# EAGLE board Fuel_Cell_Controller (EAGLE 9.1.1), part 1 of 2
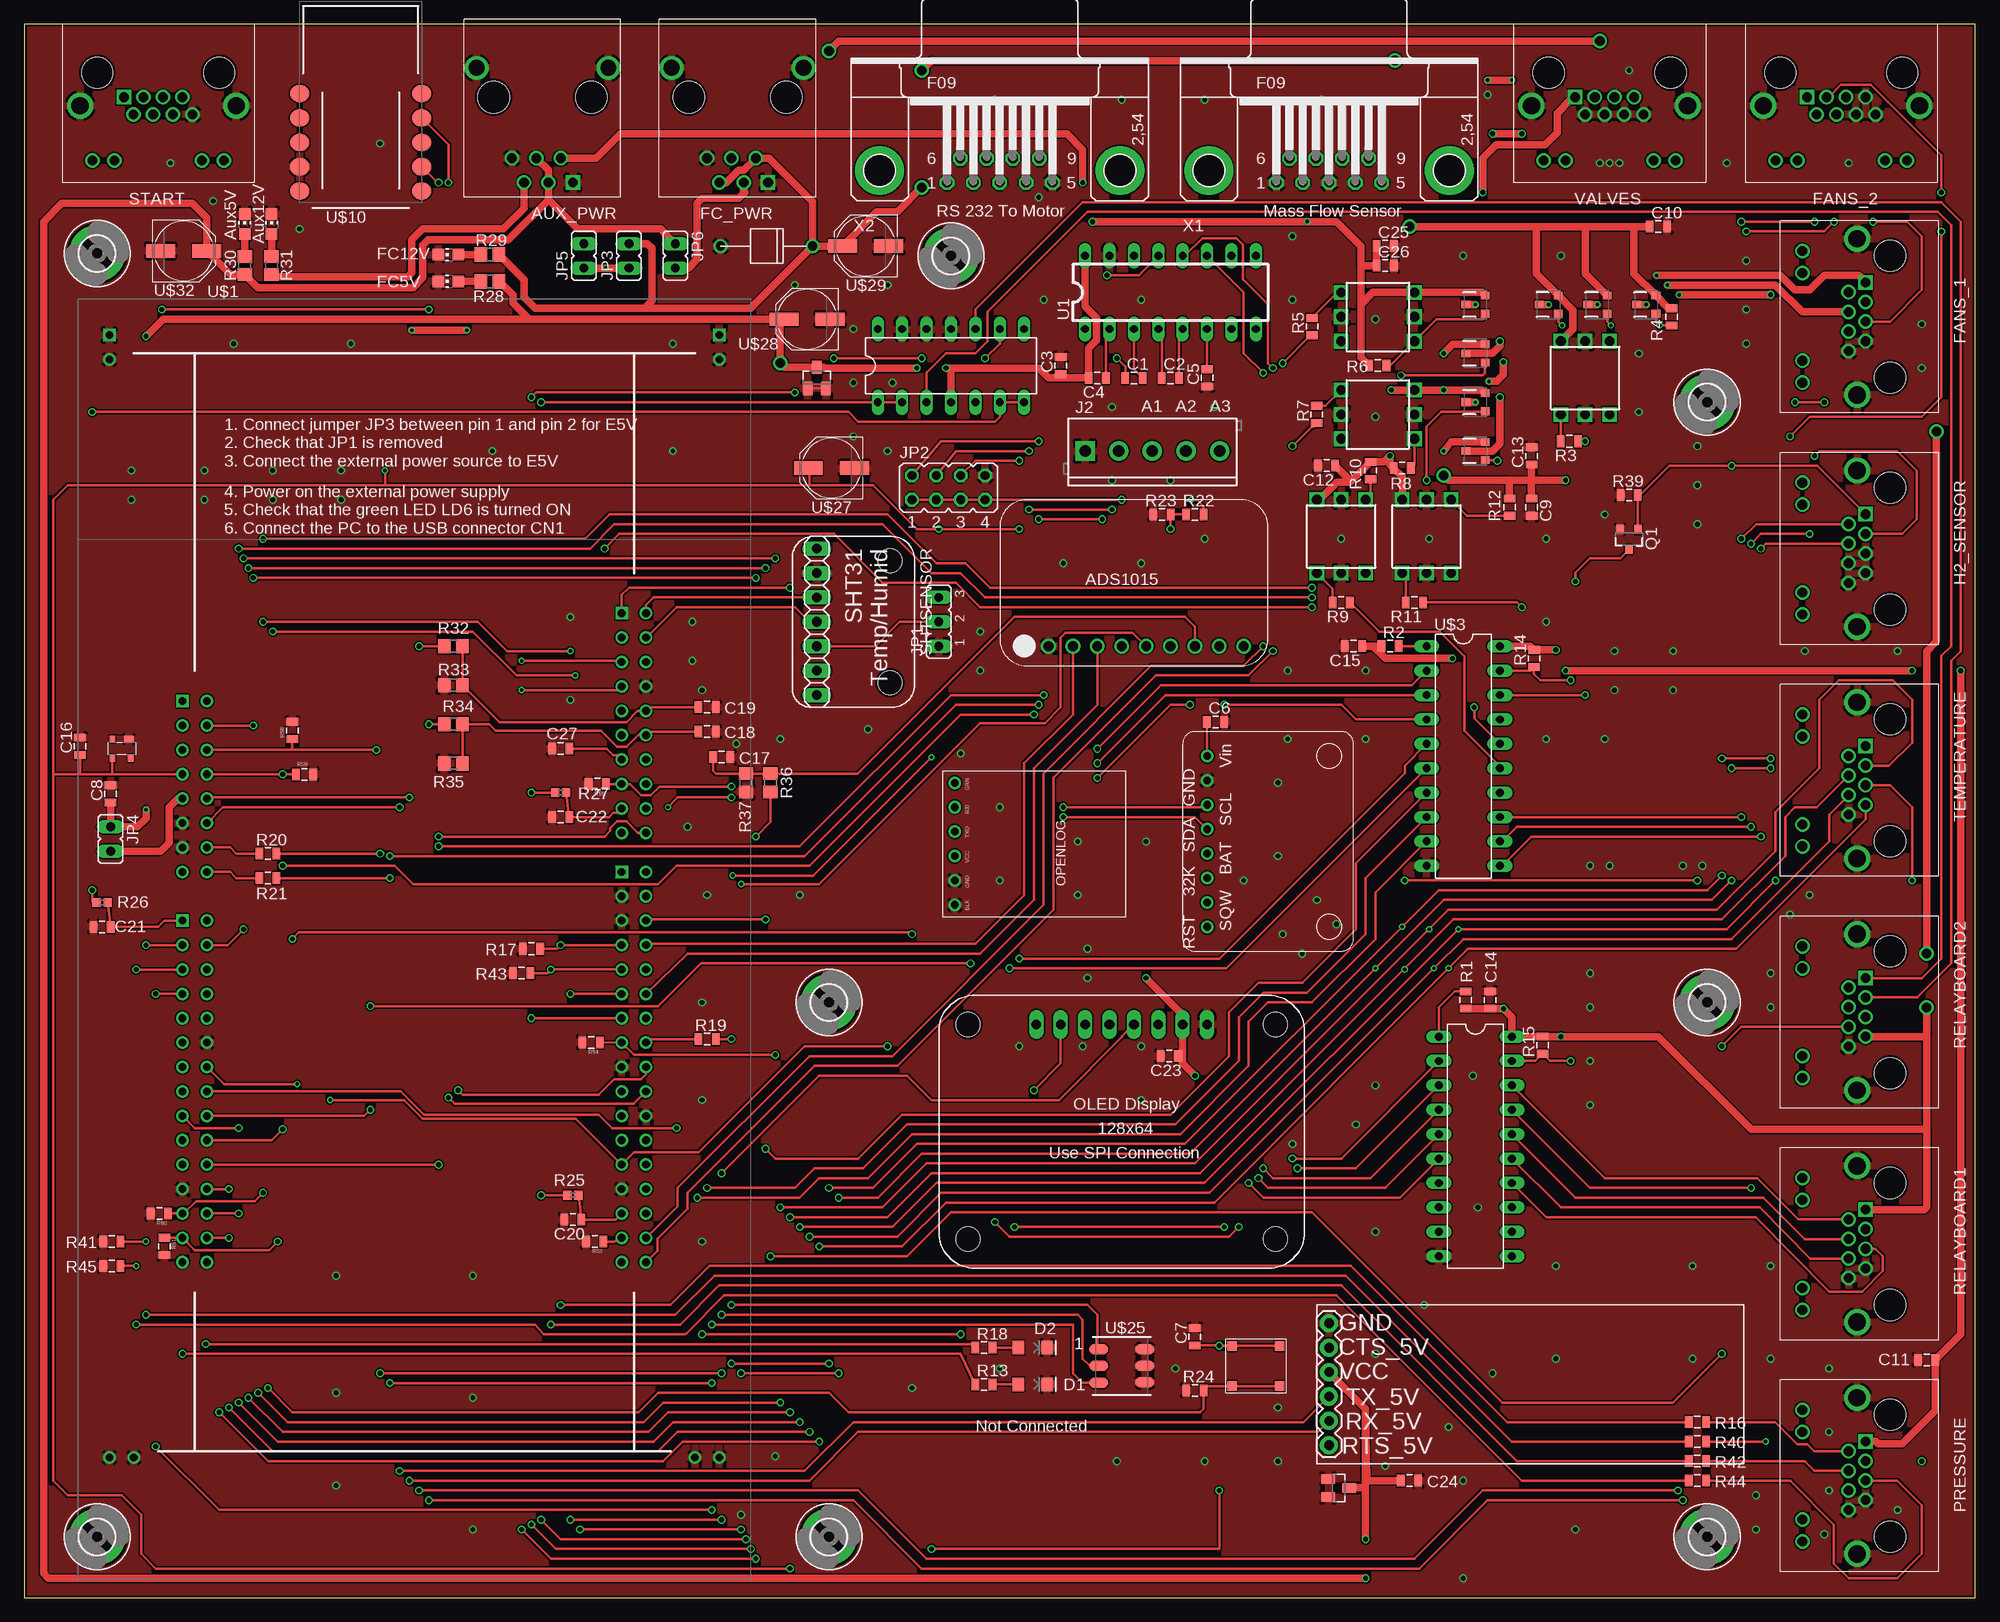
[diagram p10: board, top side]
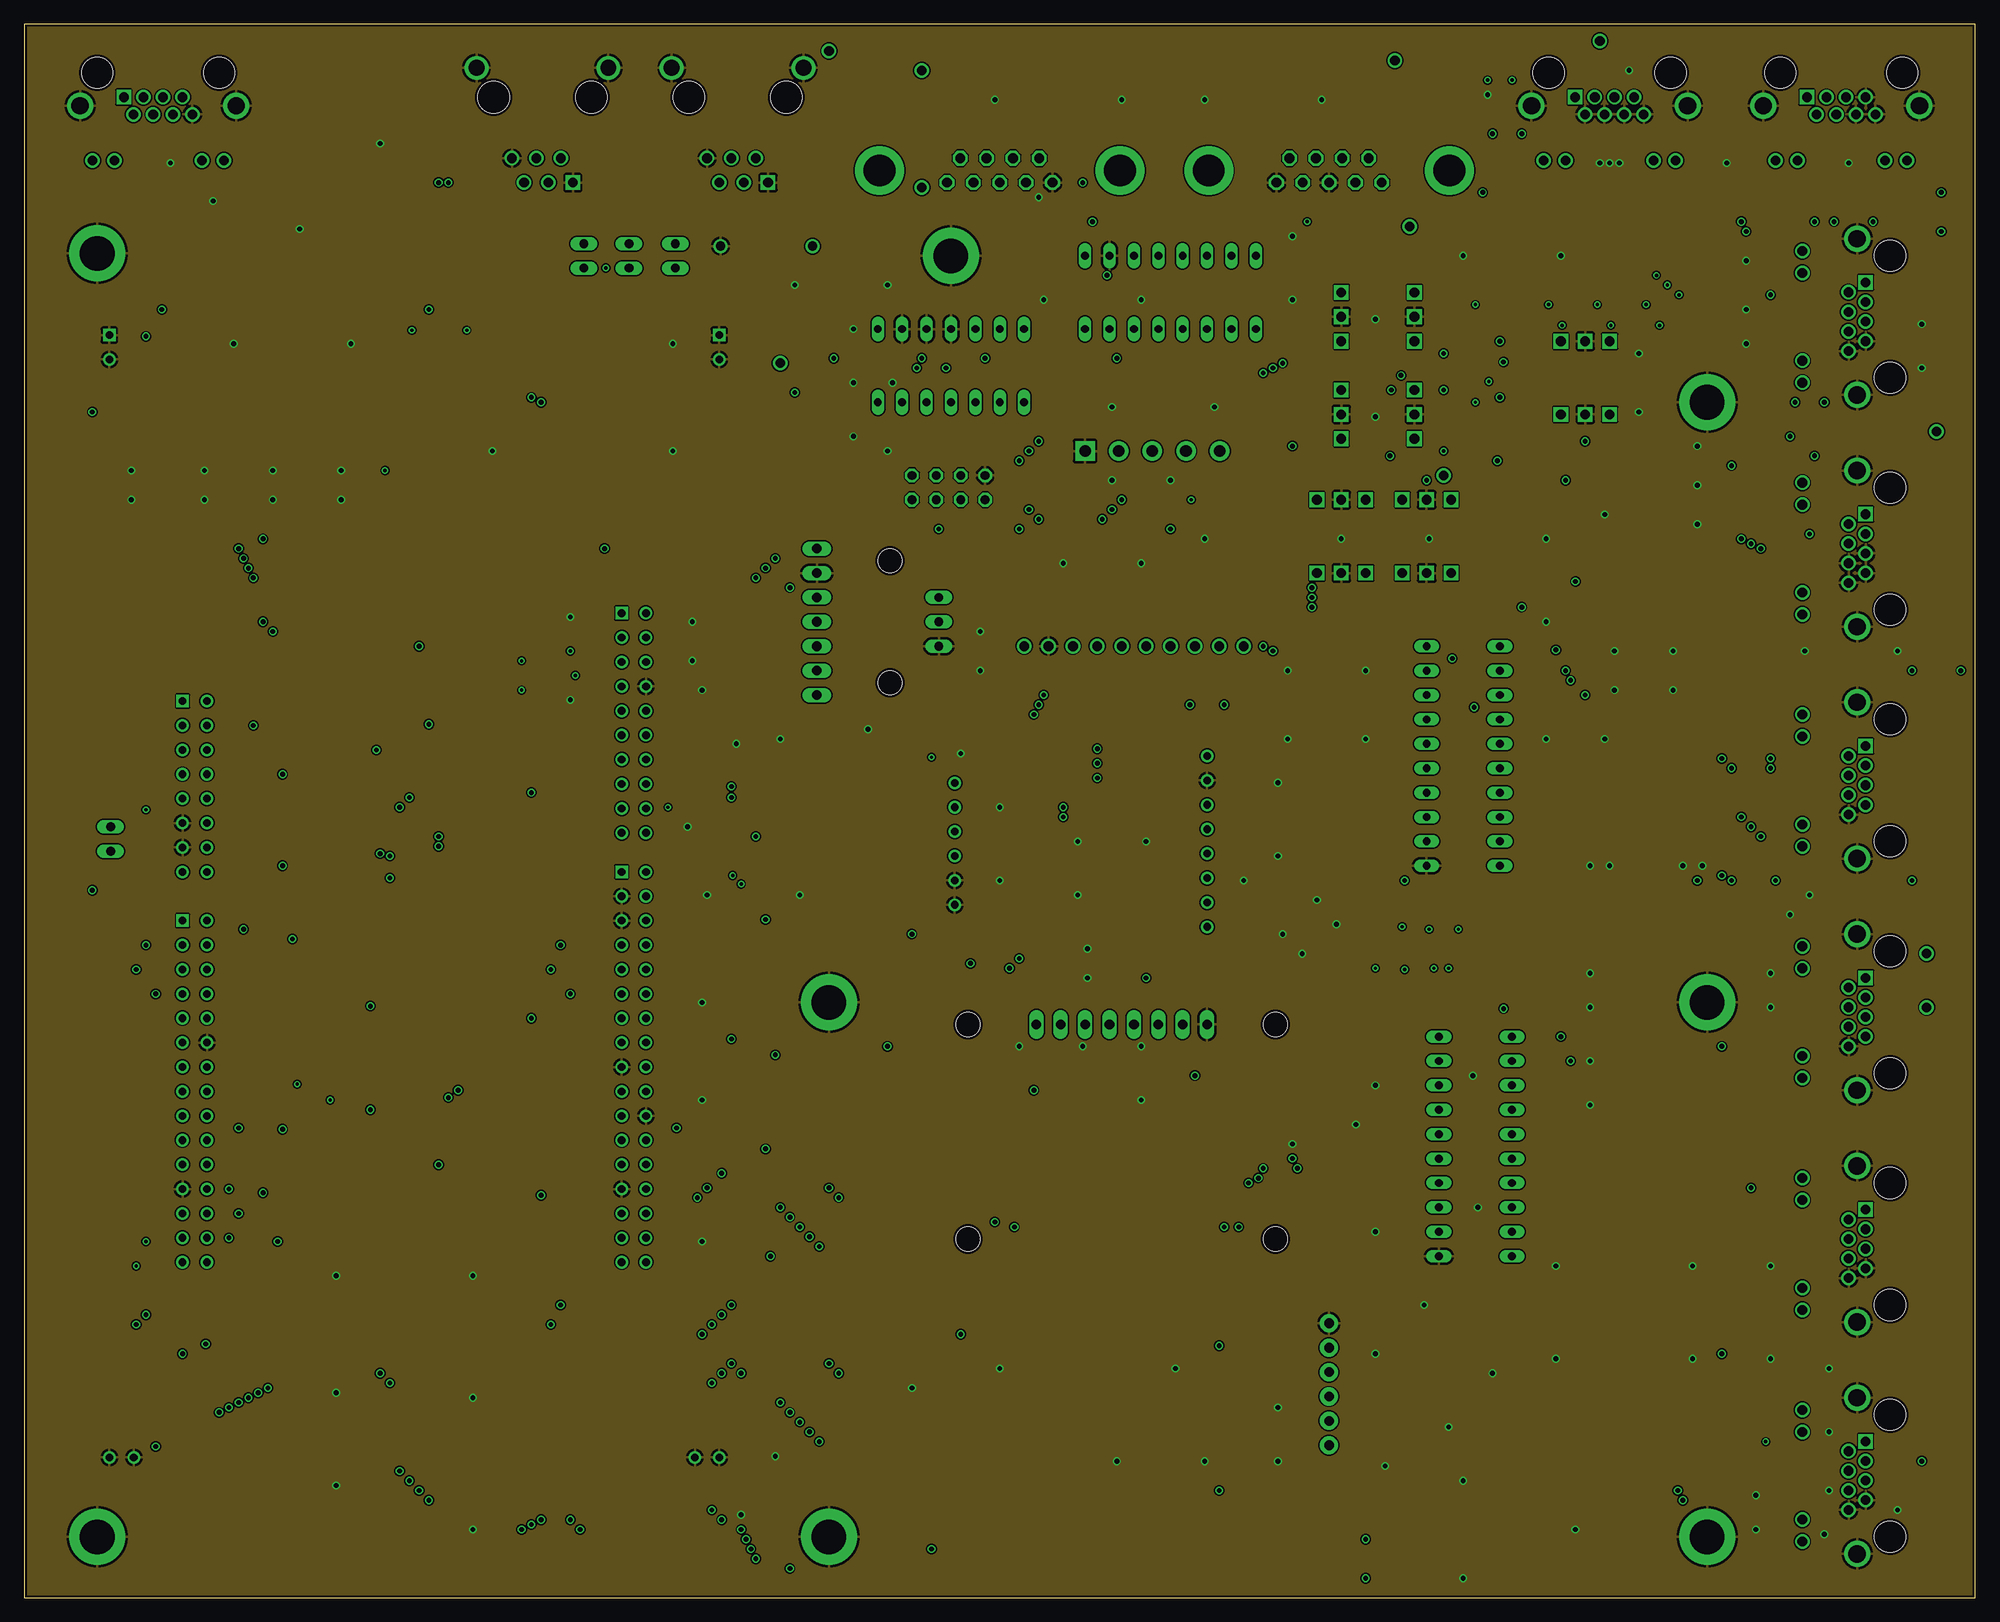
[diagram p11: board, inner layer Route15]
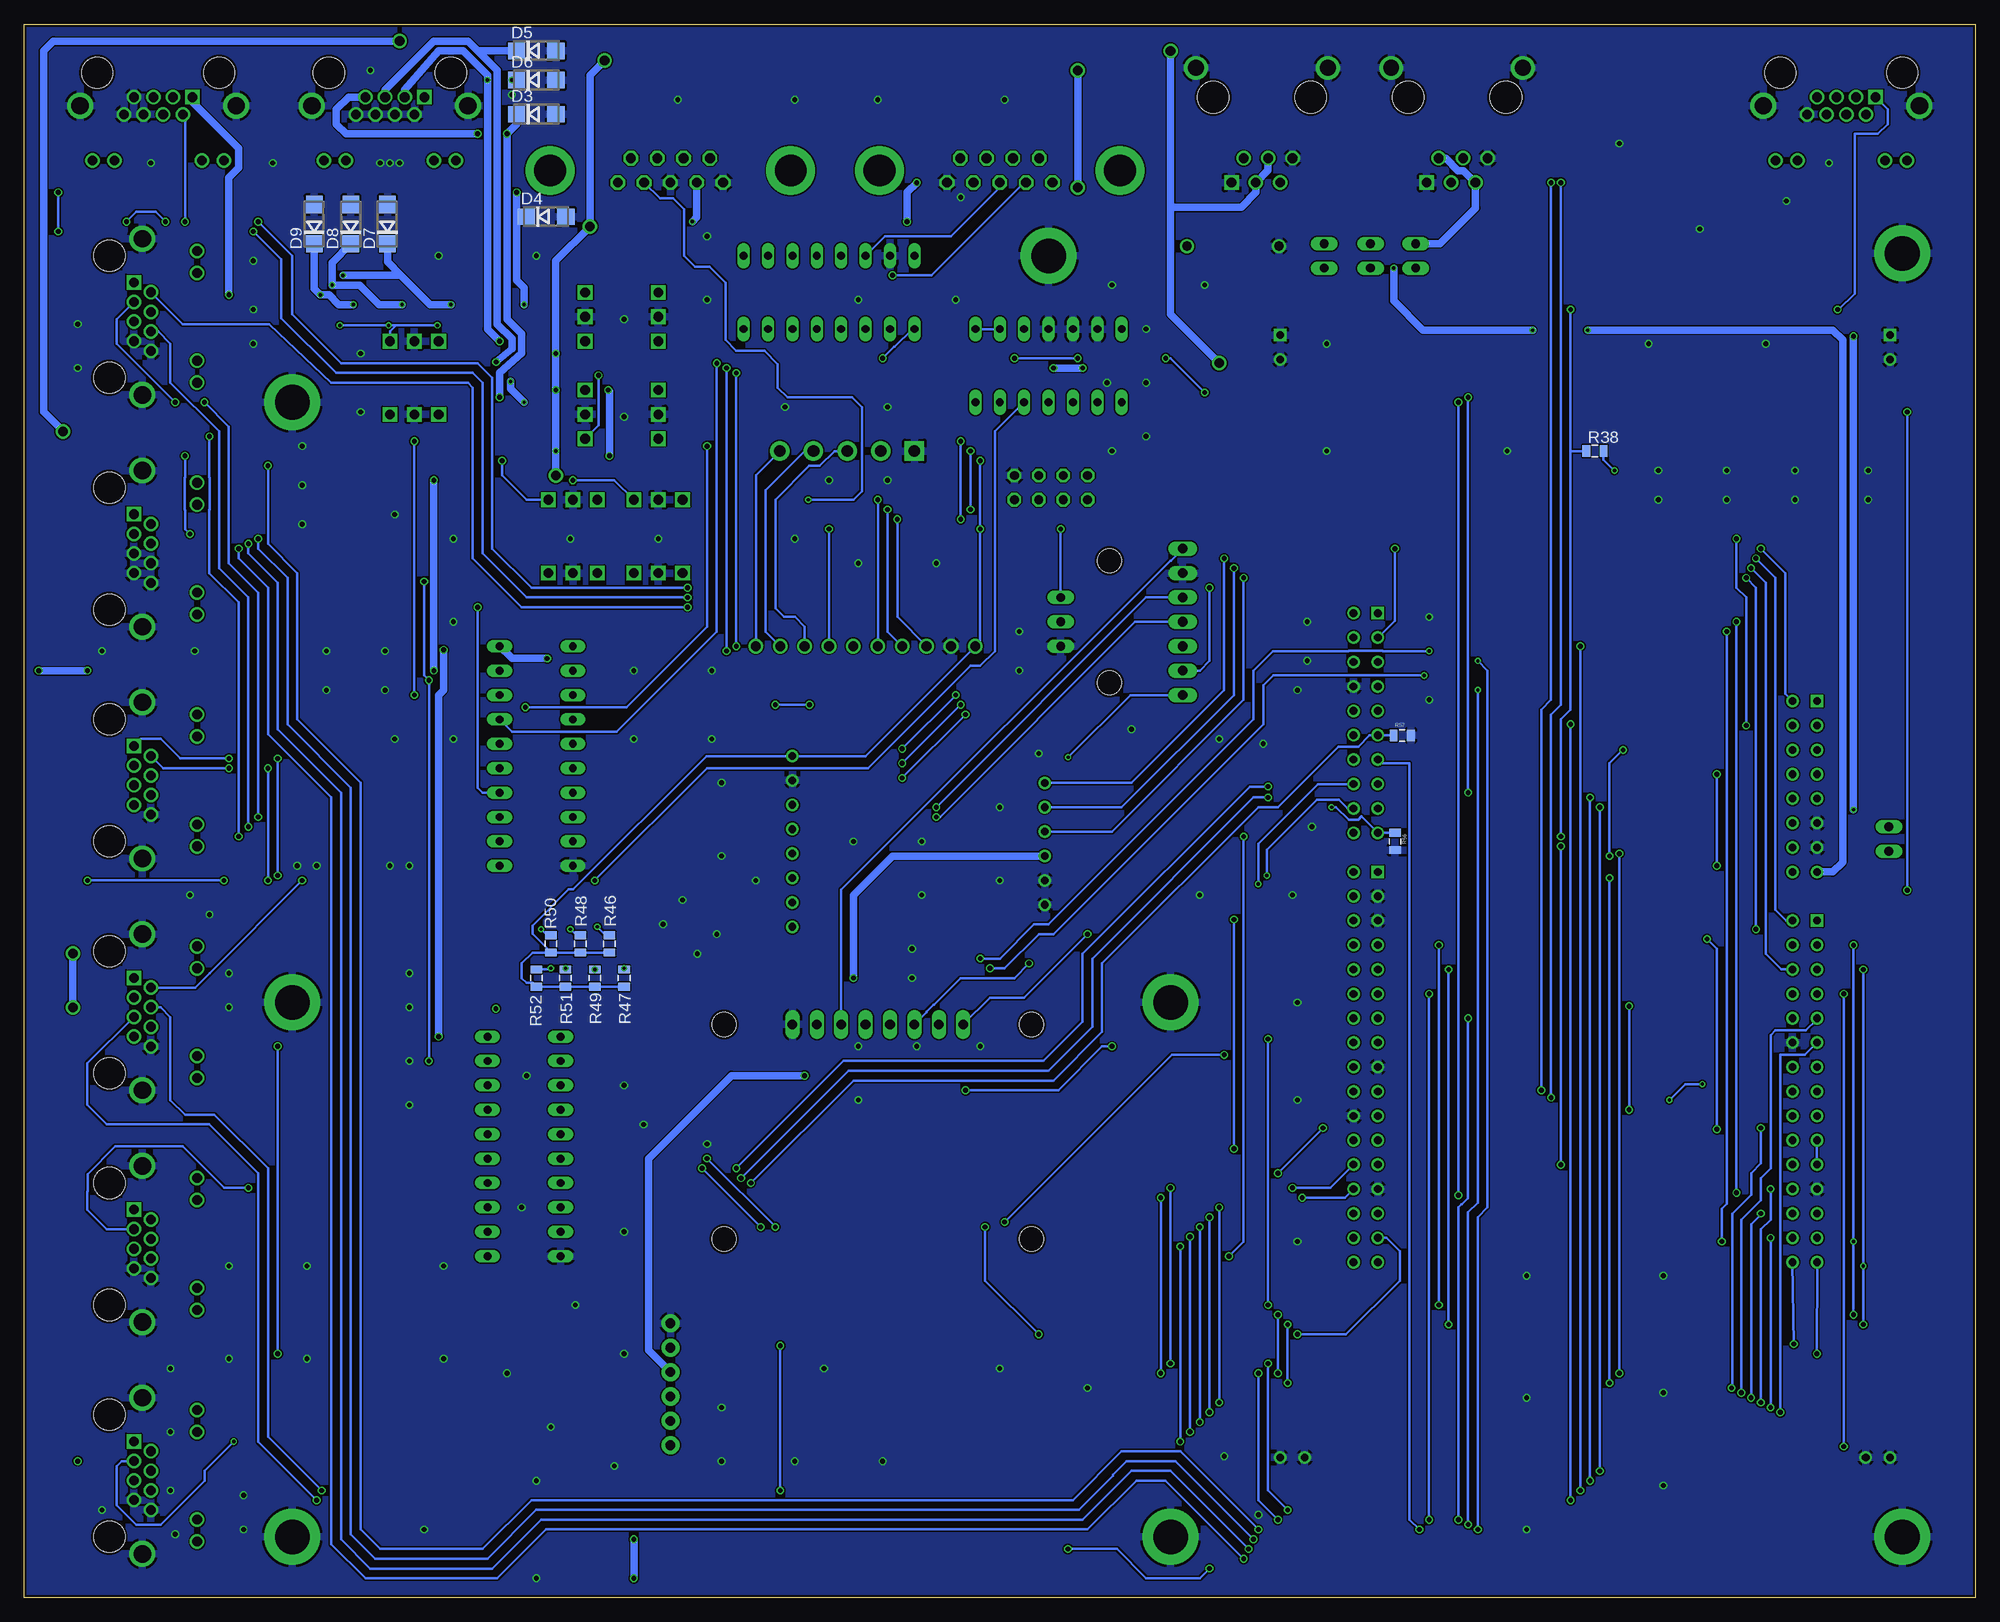
[diagram p12: board, bottom side, seen from below]

Size 203.2 x 163.83 mm. Coordinates in mm from the lower left corner, seen from the top.
Outline: 0,0 203.2,0 203.2,163.83 0,163.83 0,0
Copper layers (1+2+15+16): Top 0.035mm / dielectric 0.75mm / Route2 0.035mm / dielectric 0.75mm / Route15 0.035mm / dielectric 0.75mm / Bottom 0.035mm
Design rules "SeeedStudio_2layer_DRU_no_angle_20140221 *": minimum track width 6mil, minimum drill 12mil, track to track 6mil, track to pad 6mil, pad to pad 6mil, via to via 6mil, smd to smd 0mil, copper to edge 10mil, drill to drill 10mil, minimum pad ring 10mil, minimum via ring 6mil, stop-mask expansion 2mil, vias tented up to drill 100mil, thermal gap 10mil

## Footprints (pad centres in the part's own frame; a part is rotated, then mirrored left to right if it is on the bottom)
CHIP-LED0805 = smd 1.2 x 1.2: A 0,-1.05; C 0,1.05
1734723-1_RJ11 = drill 1 square: 1 -3.81,2.54 | drill 1: 2 -2.54,0; 3 -1.27,2.54; 4 0,0; 5 1.27,2.54; 6 2.54,0 | drill 1.65: SH1 -7.5,-9.4; SH2 6.22,-9.4 | hole 3.3: -5.72,-6.35; 4.44,-6.35
0805 = smd 0.8 x 1.2: 1 -0.9,0; 2 0.9,0
LED-1206 = smd 1.2 x 1.4: A -1.5,0; C 1.5,0
DO214AC = smd 1.8 x 1.7: A 2.05,0; C -2.05,0
A122645-ND = drill 1 square: P$1 3.58,2.54 | drill 1: P$2 2.56,4.32; P$3 1.54,2.54; P$4 0.52,4.32; P$5 -0.5,2.54; P$6 -1.52,4.32; P$7 -2.54,2.54; P$8 -3.56,4.32; P$9 -6.86,9.14; P$10 -4.57,9.14; P$11 4.57,9.14; P$12 6.86,9.14 | drill 1.8: P$13 -8.13,3.43; P$14 8.13,3.43 | hole 3.25: -6.35,0; 6.35,0
3,6-PAD = drill 3.6 pad 5.842: B3,6 0,0
1X06BLUETOOTH = drill 1.016 pad 1.88: 1 43.18,1.905; 2 43.18,4.445; 3 43.18,6.985; 4 43.18,9.525; 5 43.18,12.065; 6 43.18,14.605
SCREWTERMINAL-3.5MM-5 = drill 1.2 pad 2.032 square: 1 0,0 | drill 1.2 pad 2.032: 2 3.5,0; 3 7,0; 4 10.5,0; 5 14,0
JP2 = drill 0.914 long: 1 -2.54,0; 2 0,0; 3 2.54,0
JP4Q = drill 0.914 octagon: 1 -3.81,-1.27; 2 -3.81,1.27; 3 -1.27,-1.27; 4 -1.27,1.27; 5 1.27,-1.27; 6 1.27,1.27; 7 3.81,-1.27; 8 3.81,1.27
JP1 = drill 0.914 long: 1 0,-1.27; 2 0,1.27
DIL14 = drill 0.813 long: 1 -7.62,-3.81; 2 -5.08,-3.81; 3 -2.54,-3.81; 4 0,-3.81; 5 2.54,-3.81; 6 5.08,-3.81; 7 7.62,-3.81; 8 7.62,3.81; 9 5.08,3.81; 10 2.54,3.81; 11 0,3.81; 12 -2.54,3.81; 13 -5.08,3.81; 14 -7.62,3.81
SOT23-3 = smd 0.8 x 0.9: 1 -0.95,-1; 2 0.95,-1; 3 0,1.1
0402 = smd 0.85 x 0.9: 1 -0.58,0; 2 0.58,0
R0805 = smd 1.3 x 1.5: 1 -0.95,0; 2 0.95,0
1X07-SHT31-DIS = drill 1.016 long: 1 -7.62,0; 2 -5.08,0; 3 -2.54,0; 4 0,0; 5 2.54,0; 6 5.08,0; 7 7.62,0 | hole 2.54: -6.35,7.62; 6.35,7.62
DIL16 = drill 0.813 long: 1 -8.89,-3.81; 2 -6.35,-3.81; 3 -3.81,-3.81; 4 -1.27,-3.81; 5 1.27,-3.81; 6 3.81,-3.81; 7 6.35,-3.81; 8 8.89,-3.81; 9 8.89,3.81; 10 6.35,3.81; 11 3.81,3.81; 12 1.27,3.81; 13 -1.27,3.81; 14 -3.81,3.81; 15 -6.35,3.81; 16 -8.89,3.81
NUCLEO-F746ZG = drill 0.8: 3V3 -24.13,17.151; 5V -24.13,14.611; AGND 21.59,4.451; AVDD1 24.13,28.835; GND1 -24.13,12.071; GND2 -24.13,9.531; GND4 -31.75,60.33; GND6 31.75,60.33; GND7 31.75,-53.969; GND8 29.21,-53.969; GND9 -29.21,-53.969; GND10 -31.75,-53.969; GND11 -24.13,-26.029; GND12 -21.59,-10.789; GND13 24.13,26.295; GND14 21.59,-13.329; GND15 21.59,-26.029; GND16 21.59,1.911; GND17 24.13,-18.409; IOREF -24.13,22.231; NC2 -24.13,-13.329; NRST -24.13,19.691; PA_0 21.59,-28.569; PA_4 21.59,13.595; PA_5 24.13,23.755; PA_6 24.13,21.215; PA_7A -24.13,-15.869; PA_7B 24.13,18.675; PA_15 21.59,23.755; PB_0 21.59,-31.109; PB_1 21.59,-0.629; PB_2 21.59,-10.789; PB_3 21.59,16.135; PB_4 21.59,11.055; PB_5 21.59,18.675; PB_6 21.59,-8.249; PB_8 24.13,33.915; PB_9 24.13,31.375; PB_10 24.13,-31.109; PB_11 24.13,-33.649; PB_12 21.59,26.295; PB_13 21.59,28.835; PB_15 21.59,31.375; PC_0 -24.13,-0.629; PC_2 21.59,-3.169; PC_3 -24.13,-3.169; PC_7 21.59,21.215; PC_8 -21.59,24.771; PC_9 -21.59,22.231; PC_10 -21.59,19.691; PC_11 -21.59,17.151; PC_12 -21.59,14.611; PD_0 -24.13,-28.569; PD_1 -24.13,-31.109; PD_2 -21.59,12.071; PD_3 -21.59,-8.249; PD_4 -21.59,-5.709; PD_5 -21.59,-3.169; PD_6 -21.59,-0.629; PD_7 -21.59,1.911; PD_11 21.59,-20.949; PD_12 21.59,-18.409; PD_13 21.59,-15.869; PD_14 24.13,16.135; PD_15 24.13,13.595; PE_0 21.59,-33.649; PE_2A -21.59,-13.329; PE_2B 21.59,-23.489; PE_3 -21.59,-23.489; PE_4 -21.59,-15.869; PE_5 -21.59,-18.409; PE_6 -21.59,-20.949; PE_7 24.13,-15.869; PE_8 24.13,-13.329; PE_9 24.13,4.451; PE_10 24.13,-20.949; PE_11 24.13,1.911; PE_12 24.13,-23.489; PE_13 24.13,-3.169; PE_14 24.13,-26.029; PE_15 24.13,-28.569; PF_2 -24.13,-18.409; PF_3 -24.13,-5.709; PF_4 21.59,-5.709; PF_5 -24.13,-8.249; PF_7 -21.59,-28.569; PF_8 -21.59,-26.029; PF_9 -21.59,-31.109; PF_10 -24.13,-10.789; PF_12 24.13,11.055; PF_13 24.13,6.991; PF_14 24.13,-0.629; PF_15 24.13,-5.709; PG_0 -24.13,-33.649; PG_1 -21.59,-33.649; PG_2 -21.59,9.531; PG_3 -21.59,6.991; PG_9 24.13,-10.789; PG_14 24.13,-8.249; PH_0 -24.13,-23.489; PH_1 -24.13,-20.949; VIN -24.13,6.991 | drill 0.8 square: AVDD2 21.59,6.991; GND3 -31.75,62.87; GND5 31.75,62.87; NC1 -24.13,24.771; PA_3 -24.13,1.911; PC_6 21.59,33.915
OPENLOG = drill 0.8: P$1 -6.35,-8.255; P$2 -3.81,-8.255; P$3 -1.27,-8.255; P$4 1.27,-8.255; P$5 3.81,-8.255; P$6 6.35,-8.255
DIL20 = drill 0.813 long: 1 -11.43,-3.81; 2 -8.89,-3.81; 3 -6.35,-3.81; 4 -3.81,-3.81; 5 -1.27,-3.81; 6 1.27,-3.81; 7 3.81,-3.81; 8 6.35,-3.81; 9 8.89,-3.81; 10 11.43,-3.81; 11 11.43,3.81; 12 8.89,3.81; 13 6.35,3.81; 14 3.81,3.81; 15 1.27,3.81; 16 -1.27,3.81; 17 -3.81,3.81; 18 -6.35,3.81; 19 -8.89,3.81; 20 -11.43,3.81
H11L1 = drill 1.016 square: 3 -3.81,-2.54; ANODE -3.81,2.54; CATHODE -3.81,0; GND 3.81,0; VCC 3.81,2.54; VO 3.81,-2.54
DMP3056L-7 = smd 0.8 x 0.9: D 0,1; G -0.95,-1; S 0.95,-1
UMFT234XF = smd 1.755 x 2.025: 1 -0.89,-6.35; 2 1.65,-6.35; 3 4.19,-6.35; 4 6.73,-6.35; 5 9.27,-6.35; 6 9.27,6.35; 7 6.73,6.35; 8 4.19,6.35; 9 1.65,6.35; 10 -0.89,6.35
DS3231 = drill 0.8: P$1 2.54,2.54; P$2 5.08,2.54; P$3 7.62,2.54; P$4 10.16,2.54; P$5 12.7,2.54; P$6 15.24,2.54; P$7 17.78,2.54; P$8 20.32,2.54
ADS1015 = drill 1.016: P$1 -11.43,0; P$2 -8.89,0; P$3 -6.35,0; P$4 -3.81,0; P$5 -1.27,0; P$6 1.27,0; P$7 3.81,0; P$8 6.35,0; P$9 8.89,0; P$10 11.43,0
SOT143_AVAGO = smd 1 x 0.7: GND -0.75,-1 | smd 0.6 x 0.7: IO1 0.95,-1; IO3 -0.95,1; VDD 0.95,1
SOT23 = smd 1 x 1.4: A1 -0.95,-1.1; A2 0.95,-1.1; C 0,1.1
DO-204AC = drill 0.95: ANODE 0,0; CATHODE 9.6,0
5060BRG4 = smd 2 x 1.1: 1 2.4,-1.75; 2 2.4,0; 3 2.4,1.75; 4 -2.4,1.7; 5 -2.4,0; 6 -2.4,-1.75
EG4621CT-ND = smd 1 x 1: P$1 -2.475,2.1; P$2 2.475,2.1; P$3 -2.475,-2.1; P$4 2.475,-2.1
PANASONIC_D = smd 3 x 1.4: + 2.4,0; - -2.4,0
1X08OLED = drill 1.016 long: P$1 -8.89,25.4; P$2 -6.35,25.4; P$3 -3.81,25.4; P$4 -1.27,25.4; P$5 1.27,25.4; P$6 3.81,25.4; P$7 6.35,25.4; P$8 8.89,25.4 | hole 2.54: -16.002,3.048; 16.002,3.048; 16.002,25.4; -16.002,25.4
F09HP = drill 1.016 octagon: 1 -5.486,-1.27; 2 -2.743,-1.27; 3 0,-1.27; 4 2.743,-1.27; 5 5.486,-1.27; 6 -4.115,1.27; 7 -1.372,1.27; 8 1.372,1.27; 9 4.115,1.27 | drill 3.302 pad 5.08: G1 -12.522,0; G2 12.522,0

## Placement (x,y rotation side)
AUX5VLED  [CHIP-LED0805]  22.99,143 0 top
AUX12VLED  [CHIP-LED0805]  25.78,143 0 top
AUX_PWR  5555140-6  [1734723-1_RJ11]  53.34,149.86 180 top
C1  1µF  [0805]  115.57,127 0 top
C2  1µF  [0805]  119.38,127 0 top
C3  1µF  [0805]  107.95,128.27 90 top
C4  1µF  [0805]  111.76,127 180 top
C5  1µF  [0805]  123.19,127 90 top
C6  0.1µF  [0805]  124.08,91.19 0 top
C7  0.1µF  [0805]  121.92,27.18 90 top
C8  1µF  [0805]  9.02,83.69 90 top
C9  10µF  [0805]  156.97,113.54 270 top
C10  10µF  [0805]  170.18,142.75 0 top
C11  10µF  [0805]  198.12,24.77 180 top
C12  10µF  [0805]  135.64,117.86 180 top
C13  10µF  [0805]  156.97,118.87 90 top
C14  0.1µF  [0805]  152.65,62.23 90 top
C15  0.1µF  [0805]  138.43,99.06 180 top
C16  0.1µF  [0805]  5.84,88.65 90 top
C17  [0805]  72.64,87.5 0 top
C18  [0805]  71.12,90.17 0 top
C19  [0805]  71.12,92.71 0 top
C20  [0805]  57.15,39.37 180 top
C21  [0805]  8.13,69.85 180 top
C22  [0805]  55.88,81.28 180 top
C23  1µF  [0805]  119.25,56.39 180 top
C24  1µF  [0805]  144.27,12.19 0 top
C25  10µF  [0805]  141.73,140.72 0 top
C26  10µF  [0805]  141.73,138.68 0 top
C27  1µF  [0805]  55.88,88.39 180 top
D1  RED  [LED-1206]  105.03,22.23 0 top
D2  YELLOW  [LED-1206]  105.03,26.04 0 top
D3  [DO214AC]  149.86,154.43 0 bottom
D4  [DO214AC]  148.84,143.76 0 bottom
D5  [DO214AC]  149.86,161.04 0 bottom
D6  [DO214AC]  149.86,157.99 0 bottom
D7  [DO214AC]  165.35,143 90 bottom
D8  [DO214AC]  169.16,143 90 bottom
D9  [DO214AC]  172.97,143 90 bottom
FANS_1  ETHERNET  [A122645-ND]  194.31,133.35 90 top
FANS_2  ETHERNET  [A122645-ND]  189.23,158.75 180 top
FC5VLED  [CHIP-LED0805]  44.2,137.03 90 top
FC12VLED  [CHIP-LED0805]  44.2,139.83 90 top
FC_PWR  5555140-6  [1734723-1_RJ11]  73.66,149.86 180 top
H1  MOUNT-PAD-ROUND3.6  [3,6-PAD]  175.26,124.46 0 top
H2  MOUNT-PAD-ROUND3.6  [3,6-PAD]  175.26,61.98 0 top
H2_SENSOR  ETHERNET  [A122645-ND]  194.31,109.22 90 top
H3  MOUNT-PAD-ROUND3.6  [3,6-PAD]  175.26,6.35 0 top
H4  MOUNT-PAD-ROUND3.6  [3,6-PAD]  83.82,6.35 0 top
H5  MOUNT-PAD-ROUND3.6  [3,6-PAD]  83.82,61.98 0 top
H6  MOUNT-PAD-ROUND3.6  [3,6-PAD]  96.52,139.7 0 top
H7  MOUNT-PAD-ROUND3.6  [3,6-PAD]  7.62,139.95 0 top
H8  MOUNT-PAD-ROUND3.6  [3,6-PAD]  7.62,6.35 0 top
J1  BLUETOOTH  [1X06BLUETOOTH]  179.07,30.48 180 top
J2  [SCREWTERMINAL-3.5MM-5]  110.49,119.38 0 top
JP1  [JP2]  95.25,101.6 90 top
JP2  [JP4Q]  96.27,115.57 0 top
JP3  [JP1]  62.99,139.7 0 top
JP4  [JP1]  9.02,78.99 180 top
JP5  [JP1]  58.29,139.7 0 top
JP6  [JP1]  67.82,139.7 180 top
LP_FILTER_OP_AMP  TLV2404TLV2404  [DIL14]  96.52,128.27 0 top
PRESSURE  ETHERNET  [A122645-ND]  194.31,12.7 90 top
Q1  5.8A/30V/35mΩ  [SOT23-3]  167.13,110.24 180 top
R1  1kΩ  [0805]  150.11,62.23 90 top
R2  1kΩ  [0805]  142.24,99.06 0 top
R3  470Ω  [0805]  160.91,120.4 180 top
R4  10kΩ  [0805]  171.58,133.35 270 top
R5  470Ω  [0805]  134.11,132.33 90 top
R6  10kΩ  [0805]  140.97,128.27 0 top
R7  470Ω  [0805]  134.62,123.19 90 top
R8  10kΩ  [0805]  143.51,117.6 0 top
R9  470Ω  [0805]  137.16,103.63 180 top
R10  10kΩ  [0805]  140.21,117.35 270 top
R11  470Ω  [0805]  144.78,103.63 180 top
R12  10kΩ  [0805]  154.69,113.54 270 top
R13  324Ω  [0805]  99.95,22.23 0 top
R14  10kΩ  [0805]  157.23,97.79 90 top
R15  10kΩ  [0805]  158.12,57.53 90 top
R16  10kΩ  [0805]  174.24,18.29 0 top
R17  10kΩ  [0805]  52.83,67.56 0 top
R18  324Ω  [0805]  99.95,26.04 0 top
R19  324Ω  [0805]  71.12,58.17 0 top
R20  324Ω  [0805]  25.4,77.47 0 top
R21  324Ω  [0805]  25.4,74.93 0 top
R22  1kΩ  [0805]  121.92,112.78 0 top
R23  1kΩ  [0805]  118.49,112.78 0 top
R24  10kΩ  [0805]  121.92,21.59 0 top
R25  [0402]  57.15,41.91 180 top
R26  [0402]  8.13,72.39 180 top
R27  [0402]  55.88,83.82 0 top
R28  604Ω  [R0805]  48.51,137.03 0 top
R29  604Ω  [R0805]  48.51,139.83 0 top
R30  324Ω  [R0805]  22.99,138.68 270 top
R31  324Ω  [R0805]  25.78,138.68 270 top
R32  [R0805]  44.7,99.06 0 top
R33  [R0805]  44.7,95 180 top
R34  [R0805]  44.7,90.93 0 top
R35  [R0805]  44.7,86.87 180 top
R36  [R0805]  77.72,84.84 90 top
R37  [R0805]  75.18,84.84 270 top
R38  1kΩ  [0805]  39.62,119.38 0 bottom
R39  10kΩ  [0805]  167.13,114.81 0 top
R40  10kΩ  [0805]  174.24,16.26 0 top
R41  10kΩ  [0805]  9.14,37.08 0 top
R42  10kΩ  [0805]  174.24,14.22 0 top
R43  10kΩ  [0805]  51.82,65.02 0 top
R44  10kΩ  [0805]  174.24,12.19 0 top
R45  10kΩ  [0805]  9.14,34.54 0 top
R46  100kΩ  [0805]  142.24,68.07 90 bottom
R47  100kΩ  [0805]  140.72,64.52 90 bottom
R48  100kΩ  [0805]  145.29,68.07 90 bottom
R49  100kΩ  [0805]  143.76,64.52 90 bottom
R50  100kΩ  [0805]  148.34,68.07 270 bottom
R51  100kΩ  [0805]  146.81,64.52 270 bottom
R52  100kΩ  [0805]  149.86,64.52 270 bottom
R53  10kΩ  [0805]  59.44,37.08 180 top
R54  10kΩ  [0805]  59.04,57.81 180 top
R55  10kΩ  [0805]  59.69,84.71 180 top
R56  10kΩ  [0805]  60.45,78.74 270 bottom
R57  10kΩ  [0805]  59.69,89.79 0 bottom
R58  10kΩ  [0805]  27.94,90.3 90 top
R59  10kΩ  [0805]  29.21,85.72 0 top
R60  10kΩ  [0805]  14.1,40.01 180 top
R61  10kΩ  [0805]  14.61,36.58 270 top
RELAYBOARD1  ETHERNET  [A122645-ND]  194.31,36.83 90 top
RELAYBOARD2  ETHERNET  [A122645-ND]  194.31,60.96 90 top
SHTSENSOR  SHT31-DIS  [1X07-SHT31-DIS]  82.55,101.6 270 top
START  ETHERNET  [A122645-ND]  13.97,158.75 180 top
TEMPERATURE  ETHERNET  [A122645-ND]  194.31,85.09 90 top
U1  MAX232PTH  [DIL16]  119.38,135.89 0 top
U$1  NUCLEO-F746ZGNUCLEO-F746ZG  [NUCLEO-F746ZG]  40.64,68.58 0 top
U$2  OPENLOG  [OPENLOG]  105.16,78.49 270 top
U$3  SN74LVC245AN  [DIL20]  149.86,87.63 270 top
U$4  H11L1H11L1  [H11L1]  162.56,127 90 top
U$5  SN74LVC245AN  [DIL20]  151.13,46.99 270 top
U$6  H11L1H11L1  [H11L1]  140.97,133.35 0 top
U$7  DMP3056L-7DMP3056L-7  [DMP3056L-7]  158.75,134.62 90 top
U$8  DMP3056L-7DMP3056L-7  [DMP3056L-7]  163.83,134.62 90 top
U$9  DMP3056L-7DMP3056L-7  [DMP3056L-7]  168.91,134.62 90 top
U$10  UMFT234XF  [UMFT234XF]  35.05,155.7 270 top
U$11  H11L1H11L1  [H11L1]  140.97,123.19 0 top
U$12  DMP3056L-7DMP3056L-7  [DMP3056L-7]  151.13,134.62 90 top
U$13  DMP3056L-7DMP3056L-7  [DMP3056L-7]  151.13,129.54 90 top
U$14  H11L1H11L1  [H11L1]  137.16,110.49 90 top
U$15  DMP3056L-7DMP3056L-7  [DMP3056L-7]  151.13,124.46 90 top
U$16  H11L1H11L1  [H11L1]  146.05,110.49 90 top
U$17  DMP3056L-7DMP3056L-7  [DMP3056L-7]  151.13,119.38 90 top
U$18  DS3231  [DS3231]  120.65,90.17 270 top
U$19  ADS1015  [ADS1015]  115.57,99.06 0 top
U$20  CD143A-SR3.3CT-ND  [SOT143_AVAGO]  10.16,88.39 180 top
U$21  641-1198-1-ND  [SOT23]  82.55,127 0 top
U$22  P6KE15A-E3/54GICT-ND  [DO-204AC]  72.52,140.72 0 top
U$25  5060BRG45060BRG4  [5060BRG4]  114.3,24.13 180 top
U$26  EG4621CT-ND  [EG4621CT-ND]  128.27,24.13 0 top
U$27  1µF  [PANASONIC_D]  84.07,117.6 180 top
U$28  1µF  [PANASONIC_D]  81.53,133.1 180 top
U$29  10µF  [PANASONIC_D]  87.63,140.72 180 top
U$30  ADAFRUITOLED  [1X08OLED]  114.3,34.29 0 top
U$31  641-1198-1-ND  [SOT23]  136.91,11.43 270 top
U$32  1µF  [PANASONIC_D]  16.64,140.21 0 top
VALVES  ETHERNET  [A122645-ND]  165.1,158.75 180 top
X1  [F09HP]  135.89,148.59 0 top
X2  [F09HP]  101.6,148.59 0 top